# EAGLE schematic SensorTestRig_V1 (EAGLE 7.6.0)
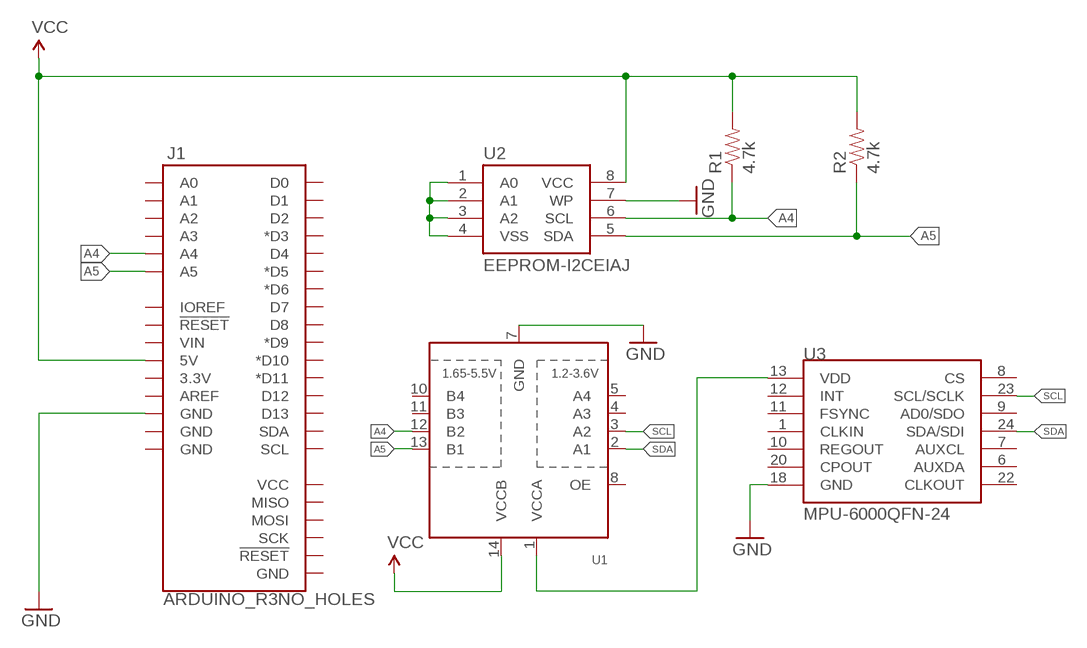
[diagram p0: schematic, sheet 1]

## Parts
J1  ARDUINO_R3NO_HOLES  [ARDUINO_R3_NO_HOLES]
R1  4.7k  RESISTORPTH-2W  [AXIAL-0.8]
R2  4.7k  RESISTORPTH-2W  [AXIAL-0.8]
U1  TXB0104PWR  [TSSOP14]
U2  EEPROM-I2CEIAJ  [SO08-EIAJ]
U3  MPU-6000QFN-24  [QFN-24-TESTING]

## Nets
A4: J1.A4 R1.P$1 U1.12(B2) U2.6(SCL)
A5: J1.A5 R2.P$1 U1.13(B1) U2.5(SDA)
GND: J1.GND@4(GND) U1.7(GND) U2.7(WP) U3.18(GND)
N$1: U2.1(A0) U2.2(A1) U2.3(A2) U2.4(VSS)
N$2: U1.1(VCCA) U3.13(VDD)
SCL: U1.3(A2) U3.23(SCL/SCLK)
SDA: U1.2(A1) U3.24(SDA/SDI)
VCC: J1.5V R1.P$2 R2.P$2 U1.14(VCCB) U2.8(VCC)
Unconnected: J1.3.3V J1.A0 J1.A1 J1.A2 J1.A3 J1.AREF J1.D0 J1.D1 J1.D2 J1.D3(*D3) J1.D4 J1.D5(*D5) J1.D6(*D6) J1.D7 J1.D8 J1.D9(*D9) J1.D10(*D10) J1.D11(*D11) J1.D12 J1.D13 J1.GND@1(GND) J1.GND@2(GND) J1.GND@3(GND) J1.IOREF J1.MISO J1.MOSI J1.RESET@1(!RESET!) J1.RESET@2(!RESET!) J1.SCK J1.SCL J1.SDA J1.VCC J1.VIN U1.4(A3) U1.5(A4) U1.8(OE) U1.10(B4) U1.11(B3) U3.1(CLKIN) U3.6(AUXDA) U3.7(AUXCL) U3.8(CS) U3.9(AD0/SDO) U3.10(REGOUT) U3.11(FSYNC) U3.12(INT) U3.20(CPOUT) U3.22(CLKOUT)

## Library data of the parts
J1 = SparkFun-Boards:ARDUINO_R3: Arduino R3 Footprint (w/ SPI header)
R1 R2 = SparkFun-Resistors:RESISTOR: Resistor Basic schematic elements and footprints for 0603, 1206, and PTH resistors.
U1 = adafruit:TXB0104PWR: 4-Bit Bi-Directional Level Shifter 1.2V-3.6V (VCCA) to 1.65V-5.5V (VCCB) bi-directional level shifter with auto direction sensing. Max data rate - VCCA 1.8V: 20Mbps (50ns), VCCA 3.3V: 100Mbps (10ns) Digikey: 296-21929-1-ND
U2 = SparkFun-DigitalIC:EEPROM-I2C: I2C EEPROM chips, 24LC256 (and others)
U3 = SparkFun-Sensors:MPU-6000: MPU-6000 - I2C address is 0x68 with AD0 low and 0x69 with AD0 high.